# EAGLE design Sub_Board (EAGLE 9.7.0)
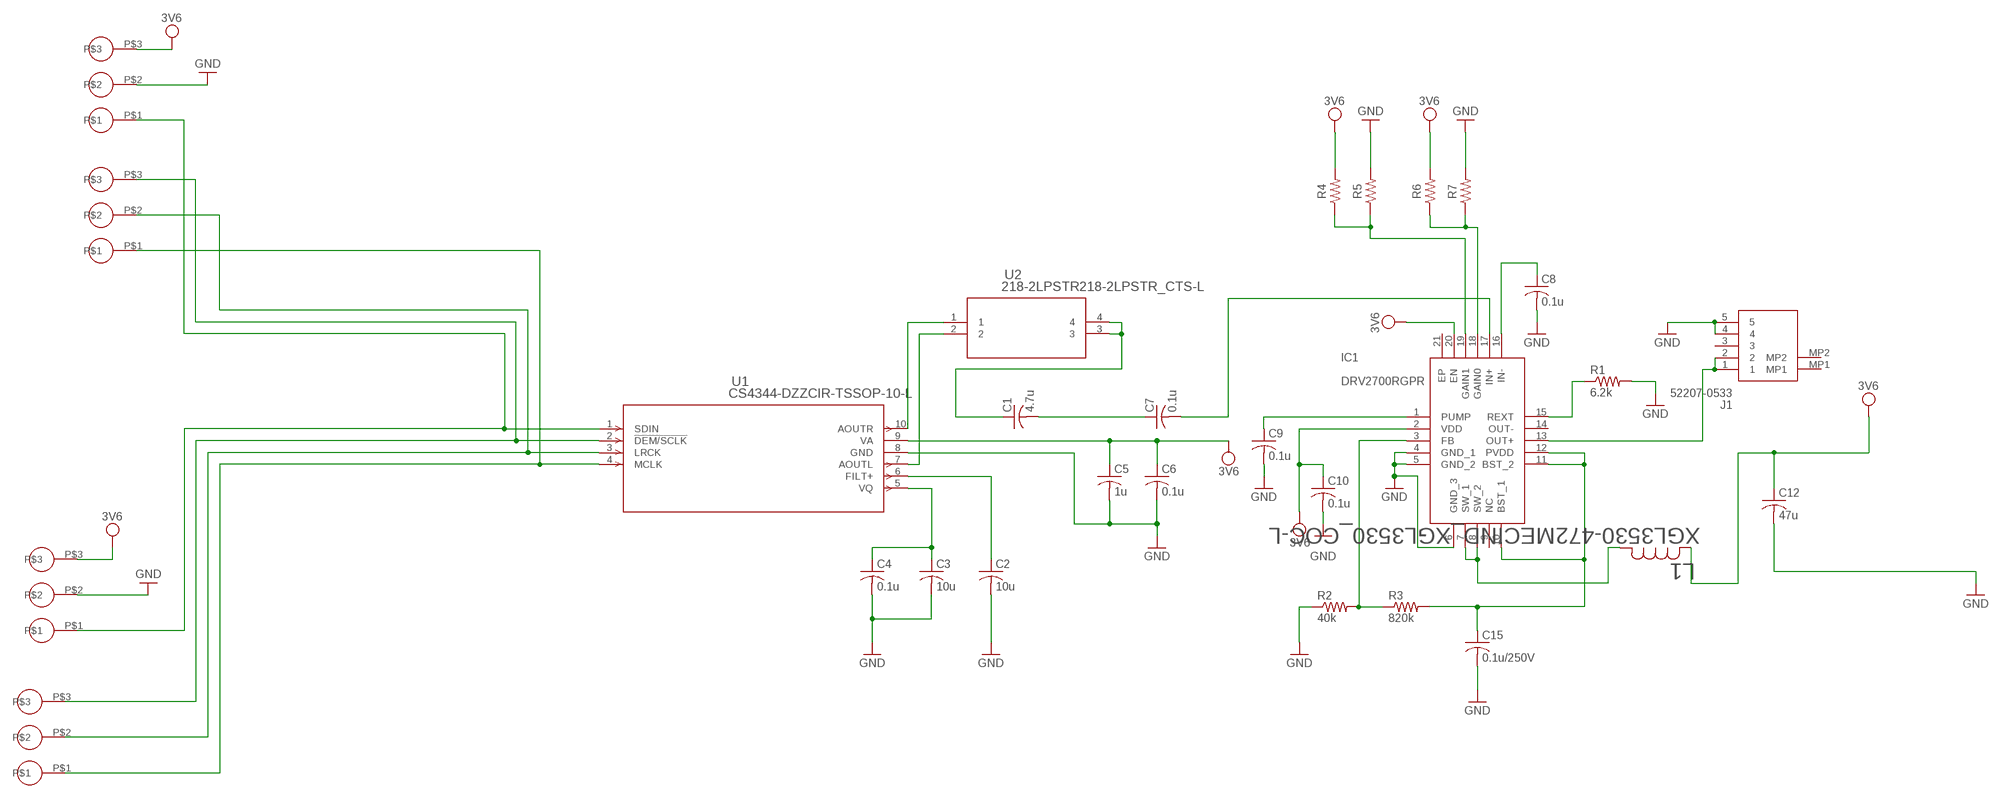
[diagram p0: schematic, sheet 1]

## Parts
C1  4.7u  C-US_CHIP-0603(1608-METRIC)  [CAPC1608X85]
C2  10u  C-US_CHIP-0603(1608-METRIC)  [CAPC1608X85]
C3  10u  C-US_CHIP-0603(1608-METRIC)  [CAPC1608X85]
C4  0.1u  C-US_CHIP-0603(1608-METRIC)  [CAPC1608X85]
C5  1u  C-US_CHIP-0603(1608-METRIC)  [CAPC1608X85]
C6  0.1u  C-US_CHIP-0603(1608-METRIC)  [CAPC1608X85]
C7  0.1u  C-US_CHIP-0603(1608-METRIC)  [CAPC1608X85]
C8  0.1u  C-US_CHIP-0603(1608-METRIC)  [CAPC1608X85]
C9  0.1u  C-US_CHIP-0603(1608-METRIC)  [CAPC1608X85]
C10  0.1u  C-US_CHIP-0603(1608-METRIC)  [CAPC1608X85]
C12  47u  C-US_CHIP-0603(1608-METRIC)  [CAPC1608X85]
C15  0.1u/250V  C-US_CHIP-1206(3216-METRIC)  [CAPC3216X135]
IC1  DRV2700RGPR  [QFN50P400X400X100-21N]
J1  52207-0533  [522070533]
L1  XGL3530-472MECIND_XGL3530_COC-L  [IND_XGL3530_COC-L]
R1  6.2k  R-US_CHIP-0603(1608-METRIC)  [RESC1608X60]
R2  40k  R-US_CHIP-0603(1608-METRIC)  [RESC1608X60]
R3  820k  R-US_CHIP-0603(1608-METRIC)  [RESC1608X60]
R4  R-US_CHIP-0603(1608-METRIC)  [RESC1608X60]
R5  R-US_CHIP-0603(1608-METRIC)  [RESC1608X60]
R6  R-US_CHIP-0603(1608-METRIC)  [RESC1608X60]
R7  R-US_CHIP-0603(1608-METRIC)  [RESC1608X60]
U1  CS4344-DZZCIR-TSSOP-10-L  [CIR-TSSOP-10-L]
U2  218-2LPSTR218-2LPSTR_CTS-L  [218-2LPSTR_CTS-L]
U$1  CONECTOR_MEM  [CONECTOR_MEM]
U$2  CONECTOR_MEM  [CONECTOR_MEM]
U$3  CONECTOR_MEM  [CONECTOR_MEM]
U$4  CONECTOR_MEM  [CONECTOR_MEM]

## Nets
3V6: C5.1 C6.1 C10.1 C12.1 IC1.2(VDD) IC1.20(EN) L1.2 R4.2 R6.2 U1.9(VA) U$1.P$3 U$3.P$3
GND: C2.2 C3.2 C4.2 C5.2 C6.2 C8.2 C9.2 C10.2 C12.2 C15.2 IC1.4(GND_1) IC1.5(GND_2) IC1.6(GND_3) J1.4 J1.5 R1.2 R2.1 R5.2 R7.2 U1.8(GND) U$1.P$2 U$3.P$2
N$1: C1.1 U2.3 U2.4
N$2: C1.2 C7.1
N$3: C7.2 IC1.17(IN+)
N$4: C8.1 IC1.16(IN-)
N$5: C2.1 U1.6(FILT+)
N$6: C3.1 C4.1 U1.5(VQ)
N$7: U1.4(MCLK) U$2.P$1 U$4.P$1
N$11: C9.1 IC1.1(PUMP)
N$12: IC1.3(FB) R2.2 R3.1
N$13: C15.1 IC1.10(BST_1) IC1.11(BST_2) IC1.12(PVDD) R3.2
N$14: IC1.15(REXT) R1.1
N$15: IC1.7(SW_1) IC1.8(SW_2) L1.1
N$17: IC1.13(OUT+) J1.1 J1.2
N$18: IC1.18(GAIN0) R6.1 R7.1
N$19: IC1.19(GAIN1) R4.1 R5.1
N$20: U1.10(AOUTR) U2.1
N$21: U1.7(AOUTL) U2.2
N$24: U1.3(LRCK) U$2.P$2 U$4.P$2
N$25: U1.2(!DEM/SCLK) U$2.P$3 U$4.P$3
N$26: U1.1(SDIN) U$1.P$1 U$3.P$1
Unconnected: IC1.9(NC) IC1.14(OUT-) IC1.21(EP) J1.3 J1.MP1 J1.MP2

## Library data of the parts
C1-C10 C12 C15 = Capacitor:C-US: Capacitor - ANSI; CATEGORY: Capacitor
IC1 = DRV2700RGPR:DRV2700RGPR: DRV2700 High Voltage Driver with Integrated Boost Converter Source: Datasheet <http://www.ti.com/lit/gpn/drv2700>; DESCRIPTION: DRV2700 High Voltage Driver with Integrated Boost Converter; HEIGHT: 1mm; MANUFACTURER_NAME: Texas Instruments; MANUFACTURER_PART_NUMBER: DRV2700RGPR; MOUSER_PART_NUMBER: 595-DRV2700RGPR; MOUSER_PRICE-STOCK: https://www.mouser.co.uk/ProductDetail/Texas-Instruments/DRV2700RGPR?qs=WuTGPxIYnC4Mk9DWLhtXMw%3D%3D
J1 = 52207-0533:52207-0533: FFC & FPC Connectors 1.0 FPC ZIF 5Ckt Sn-Ag-Bi Source: Datasheet; DESCRIPTION: FFC & FPC Connectors 1.0 FPC ZIF 5Ckt Sn-Ag-Bi; HEIGHT: 2.9mm; MANUFACTURER_NAME: Molex; MANUFACTURER_PART_NUMBER: 52207-0533; MOUSER_PART_NUMBER: 538-52207-0533; MOUSER_PRICE-STOCK: https://www.mouser.co.uk/ProductDetail/Molex/52207-0533?qs=rw2VfpiI%2FsMeNRjhHQNC0g%3D%3D
L1 = XGL3530-472MEC:XGL3530-472MEC; COPYRIGHT: Copyright (C) 2024 Ultra Librarian. All rights reserved.; MANUFACTURER_PART_NUMBER: XGL3530-472MEC; MFR_NAME: Coilcraft
R1-R3 = Tutorial - Fusion 360:R-US: Resistor Fixed - ANSI; CATEGORY: Resistor; SUB-CATEGORY: Fixed
R4-R7 = Resistor:R-US: Resistor Fixed - ANSI; CATEGORY: Resistor; SUB-CATEGORY: Fixed
U1 = CS4344:CS4344-DZZ; COPYRIGHT: Copyright (C) 2024 Ultra Librarian. All rights reserved.; MANUFACTURER_PART_NUMBER: CS4344-DZZ; MFR_NAME: Cirrus Logic
U2 = 218-2LPSTR:218-2LPSTR; COPYRIGHT: Copyright (C) 2024 Ultra Librarian. All rights reserved.; MANUFACTURER_PART_NUMBER: 218-2LPSTR; MFR_NAME: CTS Components
U$1-U$4 = CONECTOR MEM:CONECTOR_MEM

## Board
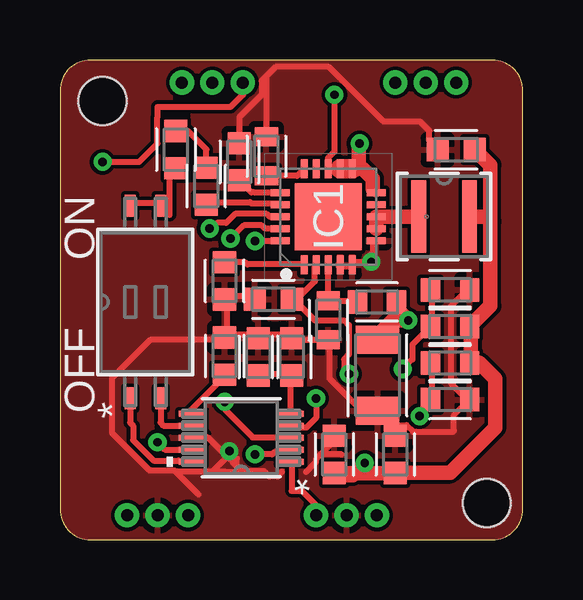
[diagram p1: board, top side]
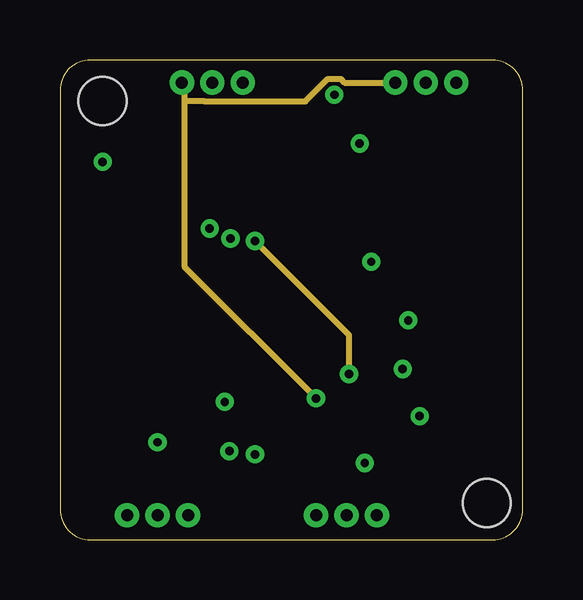
[diagram p2: board, inner layer Route2]
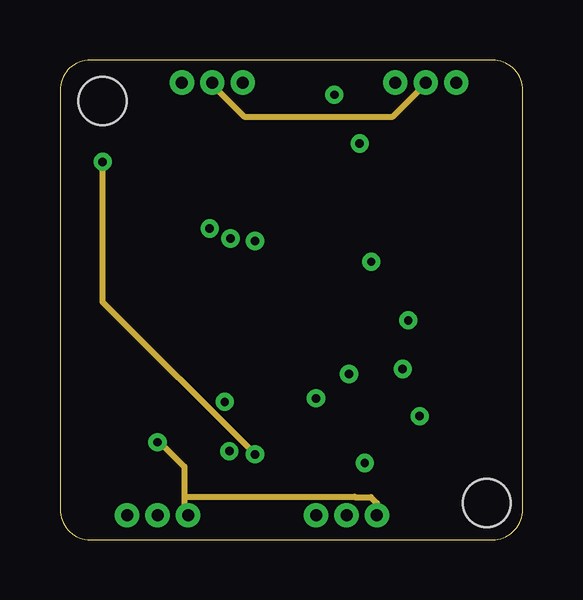
[diagram p3: board, inner layer Route15]
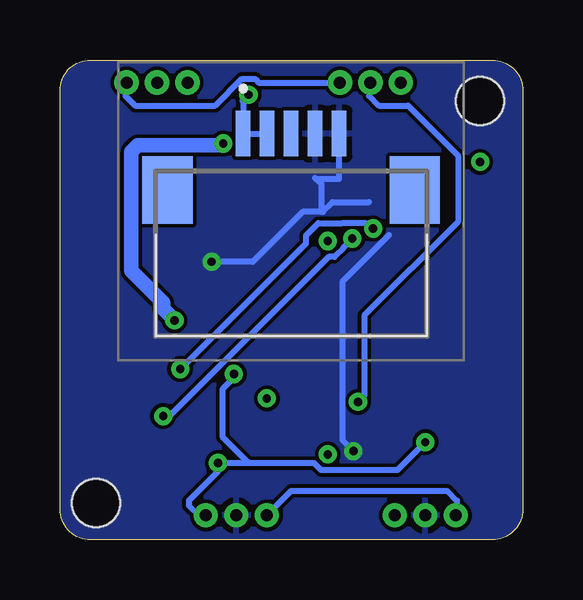
[diagram p4: board, bottom side, seen from below]

Size 19.28 x 19.99 mm. Coordinates in mm from the lower left corner, seen from the top.
Outline: 0,18.72 0,1.27 arc90 1.27,0 18.01,0 arc90 19.28,1.27 19.28,18.72 arc90 18.01,19.99 1.27,19.99 arc90 0,18.72
Copper layers (1+2*15+16): Top 0.035mm / dielectric 1.5mm / Route2 0.035mm / dielectric 0.15mm / Route15 0.035mm / dielectric 0.2mm / Bottom 0.035mm
Design rules "Fusion Electronics Design Rules *": minimum track width 10mil, minimum drill 0.35mm, track to track 6mil, track to pad 6mil, pad to pad 6mil, via to via 6mil, smd to smd 6mil, copper to edge 1mil, drill to drill 6mil, minimum pad ring 10mil, minimum via ring 8mil, stop-mask expansion 4mil, vias tented up to drill 0mil, thermal gap 10mil
Holes 2 mm at 1.78,18.29 17.78,1.52

### Footprints (pad centres in the part's own frame; a part is rotated, then mirrored left to right if it is on the bottom)
CAPC1608X85 = smd 0.921 x 0.97: 1 -0.775,0; 2 0.775,0
CAPC3216X135 = smd 1.165 x 1.815: 1 -1.475,0; 2 1.475,0
QFN50P400X400X100-21N = smd 0.8 x 0.3: 1 -2,1; 2 -2,0.5; 3 -2,0; 4 -2,-0.5; 5 -2,-1; 11 2,-1; 12 2,-0.5; 13 2,0; 14 2,0.5; 15 2,1 | smd 0.3 x 0.8: 6 -1,-2; 7 -0.5,-2; 8 0,-2; 9 0.5,-2; 10 1,-2; 16 1,2; 17 0.5,2; 18 0,2; 19 -0.5,2; 20 -1,2 | smd 2.8 x 2.8: 21 0,0
522070533 = smd 0.6 x 1.9: 1 -2,4.225; 2 -1,4.225; 3 0,4.225; 4 1,4.225; 5 2,4.225 | smd 2.1 x 2.8: MP1 -5.15,1.875; MP2 5.15,1.875
IND_XGL3530_COC-L = smd 0.61 x 3.023: 1 -1.054,0; 2 1.054,0
RESC1608X60 = smd 0.799 x 0.974: 1 -0.815,0; 2 0.815,0
CIR-TSSOP-10-L = smd 1.105 x 0.254: 1 -2.051,1; 2 -2.051,0.5; 3 -2.051,0; 4 -2.051,-0.5; 5 -2.051,-1; 6 2.051,-1; 7 2.051,-0.5; 8 2.051,0; 9 2.051,0.5; 10 2.051,1
218-2LPSTR_CTS-L = smd 0.914 x 0.457: 1 -4.013,0.635; 2 -4.013,-0.635; 3 4.013,-0.635; 4 4.013,0.635
CONECTOR_MEM = drill 0.5: P$1 0,1.27; P$2 1.27,1.27; P$3 2.54,1.27

### Placement (x,y rotation side)
C1  4.83,16.26 90 top
C2  6.86,7.65 90 top
C3  8.26,7.62 90 top
C4  9.65,7.62 90 top
C5  13.97,3.56 90 top
C6  11.43,3.56 90 top
C7  6.1,14.73 270 top
C8  7.47,15.75 90 top
C9  6.86,10.79 270 top
C10  8.89,10.02 180 top
C12  16.51,16.26 180 top
C15  13.23,6.86 270 top
IC1  11.18,13.46 90 top
J1  9.65,12.7 0 bottom
L1  16,13.46 0 top
R1  8.6,15.98 90 top
R2  11.18,9.14 90 top
R3  13.21,9.91 0 top
R4  16.26,7.37 0 top
R5  16.26,5.84 0 top
R6  16.26,8.89 0 top
R7  16.26,10.41 0 top
U1  7.56,4.26 180 top
U2  3.56,9.91 90 top
U$1  2.79,-0.25 0 top
U$2  13.97,17.78 0 top
U$3  10.67,-0.25 0 top
U$4  5.08,17.78 0 top

### Tracks (layer width: path | path; a pad name or v marks a point on that pad's centre or on a via)
3V6  (via drill 0.35)
  Top 0.254: 17.12,7.52 R4.2 | 9.8,9.96 10.62,10.77 10.62,11.38 10.68,11.44 IC1.2 | U1.9 4.37,3.76 v4.06,4.06 | 9.8,9.96 10.62,9.14 11.84,9.14 12.04,8.94 12.04,7.72 11.84,7.52 11.84,7.11 v12.04,6.91 | 9.8,9.96 C10.1 | IC1.20 9.16,12.45 v8.13,12.45
  Top 0.61: 17.12,7.52 17.12,8.84 R6.2 17.65,9.47 17.66,9.47 17.93,9.74 17.93,13.26 | R4.2 17.48,7.37 18.14,6.71 18.14,4.67 16.26,2.79 13.98,2.79 C5.1 C6.1 | L1.2 17.73,13.46 17.93,13.26 | 17.93,13.26 17.93,15.61 C12.1 | 11.44,2.79 C6.1 | C6.1 11.52,2.69 12.19,2.69 v12.7,3.2
  Route2 0.254: v8.13,12.45 12.04,8.53 v12.04,6.91
  Route15 0.254: 5.18,1.8 5.18,3.05 4.17,4.06 v4.06,4.06 | 5.18,1.8 5.18,1.02 U$1.P$3 | 5.18,1.8 12.26,1.8 12.28,1.78 12.95,1.78 13.21,1.52 U$3.P$3
  Bottom 0.254: 11.48,3.2 v12.7,3.2 12.7,3.25 12.9,3.05 12.7,2.85 13.92,1.63 13.92,1.42 13.51,1.02 U$3.P$3 | v12.04,6.91 12.09,6.91 12.09,6.71 12.5,6.3 12.5,4.27 11.48,3.25 11.48,3.2 | 11.48,3.2 8.7,3.2 8.4,2.9 5.23,2.9 v4.06,4.06
GND  (via drill 0.35)
  Top 0.254: 7.37,3.05 6.96,3.45 | 6.96,3.45 6.15,4.27 5.54,4.27 U1.8 | C10.2 7.98,10.16 6.96,10.16 C9.2 6.96,9.96 6.96,8.53 | 6.96,8.53 8.18,8.53 C3.2 8.38,8.53 9.6,8.53 C4.2 9.8,8.33 11.02,8.33 R2.1 11.23,8.13 11.23,6.72 12.47,5.49 13.06,5.49 C15.2 13.26,5.28 13.77,4.78 14.43,4.78 14.71,4.5 16.36,4.5 16.41,4.55 16.41,5.18 R5.2 16.92,5.89 16.31,6.5 16.31,9.75 16.92,10.36 R7.2 | 6.96,8.53 C2.2 6.76,8.33 3.77,8.33 2.16,6.72 2.16,4.46 3.73,2.89 4.76,2.89 4.81,2.85 6.36,2.85 6.96,3.45 | IC1.4 11.63,11.38 12.04,11.38 IC1.5 12.24,11.58 12.65,11.58 12.85,11.79 | 12.85,11.79 13.06,11.99 13.06,12.4 IC1.6 | v12.97,11.58 12.97,11.67 12.85,11.79 | 8.6,19.31 8.99,19.71 11.19,19.71 13.48,17.42 15,17.42 15.39,17.04 15.39,16.6 C12.2 | 8.6,19.31 R1.2 | 7.37,3.05 7.56,2.85 8.51,2.85 8.54,2.82 | 10.25,2.82 10.67,3.24 10.67,3.36 10.87,3.56 | 11.74,3.56 10.87,3.56 | C6.2 11.43,4.12 10.87,3.56 | C8.2 7.47,17.61 8.4,18.54 8.4,19.12 8.6,19.31 | 8.54,2.82 8.72,2.64 9.06,2.64 9.25,2.83 9.25,2.85 | 8.54,2.82 6.9,2.82 6.88,2.84 4.81,2.84 5.77,1.88 | 7.37,3.05 7.37,3.39 v7.06,3.7
  Bottom 0.254: v12.97,11.58 11.26,11.58 9.18,13.66 8.38,13.66 | J1.5 7.65,15.04 8.38,15.04 8.65,15.07 8.38,14.83 8.38,13.66 | 8.38,13.66 8.33,13.66 7.93,14.07 6.41,14.07 | 5.58,12.69 7.52,10.75 7.52,4.16 v7.06,3.7
  pour Bottom: 1.32,-8.26 20.78,-8.26 24.51,-4.52 24.51,20.78 23.32,21.97 -1.91,21.97 -1.91,-5.03
  pour Top (rank 2): -3.5,-8.76 24.08,-8.76 24.77,-8.08 24.77,21.97 -3.5,21.97 -5.46,20.01 -5.46,-6.81
N$1
  Top 0.254: C1.1 4.57,15.23 4.57,14.22 | 4.57,14.22 4.57,13.54 U2.3 | 4.57,14.22 4.17,14.22 3.96,14.02 2.95,14.02 U2.4
N$2
  Top 0.254: C7.1 6.1,16.27 5.33,17.03 C1.2
N$3
  Top 0.254: IC1.17 9.12,14.02 7.98,14.02 7.93,14.07 6.21,14.07 C7.2
N$4
  Top 0.254: IC1.16 8.11,14.46 8.09,14.48 7.97,14.48 C8.1
N$5
  Top 0.254: C2.1 6.76,6.71 5.33,5.28 U1.6
N$6
  Top 0.254: C3.1 8.38,6.91 9.6,6.91 C4.1 9.6,6.71 9.6,5.28 U1.5
N$7  (via drill 0.35)
  Top 0.254: v10.67,5.89 10.67,5.08 10.26,4.67 9.65,4.67 U1.4
  Route2 0.254: v10.67,5.89 5.18,11.38 5.18,18.29 | 5.18,18.29 5.18,18.9 U$4.P$1 | 5.18,18.29 6,18.29 6.03,18.27 10.23,18.27 11.16,19.2 11.7,19.2 11.85,19.05 U$2.P$1
N$11
  Top 0.254: C9.1 7.72,11.56 7.81,11.47 10.16,11.47 IC1.1
N$12
  Top 0.254: R3.1 12.24,9.96 11.23,9.96 R2.2 IC1.3
N$13  (via drill 0.35)
  Top 0.254: 13.87,9.14 13.87,9.75 R3.2 | 13.41,8.69 13.26,8.53 C15.1
  Top 0.406: IC1.10 13.03,14.6
  Top 0.61: R3.2 14.02,9.63 v14.51,9.14 13.87,9.14 13.41,8.69 | 13.03,14.86 13.03,15.05 | IC1.11 12.45,15.46 | 12.45,15.46 12.62,15.46 13.03,15.05 | 13.03,14.6 13.03,14.86 | 13.03,15.05 13.03,14.86 | 12.45,15.46 12.45,16.47 v12.48,16.51
  Top 0.813: IC1.12 IC1.11
  Bottom 0.61: v14.51,9.14 14.99,9.62 14.99,9.88 16.31,11.21 16.31,16.16 16.04,16.43 12.56,16.43 v12.48,16.51
N$14
  Top 0.254: IC1.15 9.88,15.16 R1.1
N$15
  Top 0.254: IC1.7 13.26,13.01 13.26,13.41 IC1.8 | 14.48,13.46 15.11,13.46 15.14,13.43 15.09,13.41 15,13.41 L1.1
  Top 0.61: IC1.7 IC1.8 14.48,13.46 L1.1
N$17  (via drill 0.35)
  Top 0.254: v11.43,18.54 11.43,16.16 11.18,15.91 IC1.13
  Bottom 0.254: J1.1 11.65,16.48 11.53,16.36 | 11.68,18.29 v11.43,18.54 11.65,18.32 J1.1 | J1.1 J1.2
N$18  (via drill 0.35)
  Top 0.254: v14.28,7.11 14.68,7.52 14.68,8.13 15.29,8.74 R6.1 15.49,8.94 15.49,10.36 R7.1 | IC1.18 8.73,13.46 8.61,13.58 7.29,13.58 6.92,13.21 6.55,13.21 6.3,12.97 v6.24,12.97
  Bottom 0.254: v14.28,7.11 9.03,12.35 9.03,12.68 8.52,13.19 7.52,13.19 7.5,13.21 6.55,13.21 6.3,12.97 v6.24,12.97
N$19  (via drill 0.35)
  Top 0.254: R4.1 15.49,7.31 15.49,5.89 R5.1 15.44,5.78 14.98,5.32 v14.98,5.15 | IC1.19 8.54,12.96 8.4,13.1 7.66,13.1 v7.1,12.55
  Bottom 0.254: v7.1,12.55 7.47,12.19 7.47,12.17 7.86,11.79 8.09,11.79 14.73,5.15 v14.98,5.15
N$20
  Top 0.254: U2.1 2.92,4.88 3.05,4.75 3.05,4.15 3.9,3.3 4.93,3.3 4.98,3.26 U1.10
N$21
  Top 0.254: U2.2 4.19,4.88 4.31,4.76 U1.7
N$24  (via drill 0.35)
  Top 0.254: U1.3 9.45,4.27 8.03,4.27 6.87,5.43 v6.87,5.75
  Route15 0.254: U$2.P$2 15.14,18.9 13.87,17.63 7.67,17.63 6.4,18.9 U$4.P$2
  Bottom 0.254: U$4.P$2 6.4,19.1 6.6,18.9 6.4,18.69 6.4,18.49 5.99,18.09 4.77,18.09 2.69,16 2.69,13.26 6.6,9.35 6.6,6.01 v6.87,5.75
N$25  (via drill 0.35)
  Top 0.254: U1.2 9.52,3.66 8.94,3.66 8.83,3.56 v8.13,3.56 | v1.78,15.75 3.3,15.75 4.06,16.51 4.06,17.61 4.06,18.03 7.11,18.03 7.62,18.54 U$4.P$3
  Route15 0.254: v8.13,3.56 1.78,9.91 v1.78,15.75
  Bottom 0.254: U$2.P$3 16.56,19.1 16.76,18.9 16.56,18.69 16.56,18.49 16.15,18.09 12.82,18.09 11.7,19.2 11.16,19.2 11.01,19.05 U$4.P$3
N$26
  Top 0.254: U1.1 9.65,3.21 9.65,2.03 10.07,2.03 | 10.07,2.03 10.08,2.04 | 10.07,2.03 10.67,1.44 U$3.P$1
  Bottom 0.254: U$3.P$1 9.65,2.03 3.15,2.03 2.74,1.63 2.74,1.02 U$1.P$1